# EAGLE schematic BSPD rev10 (EAGLE 9.6.2)
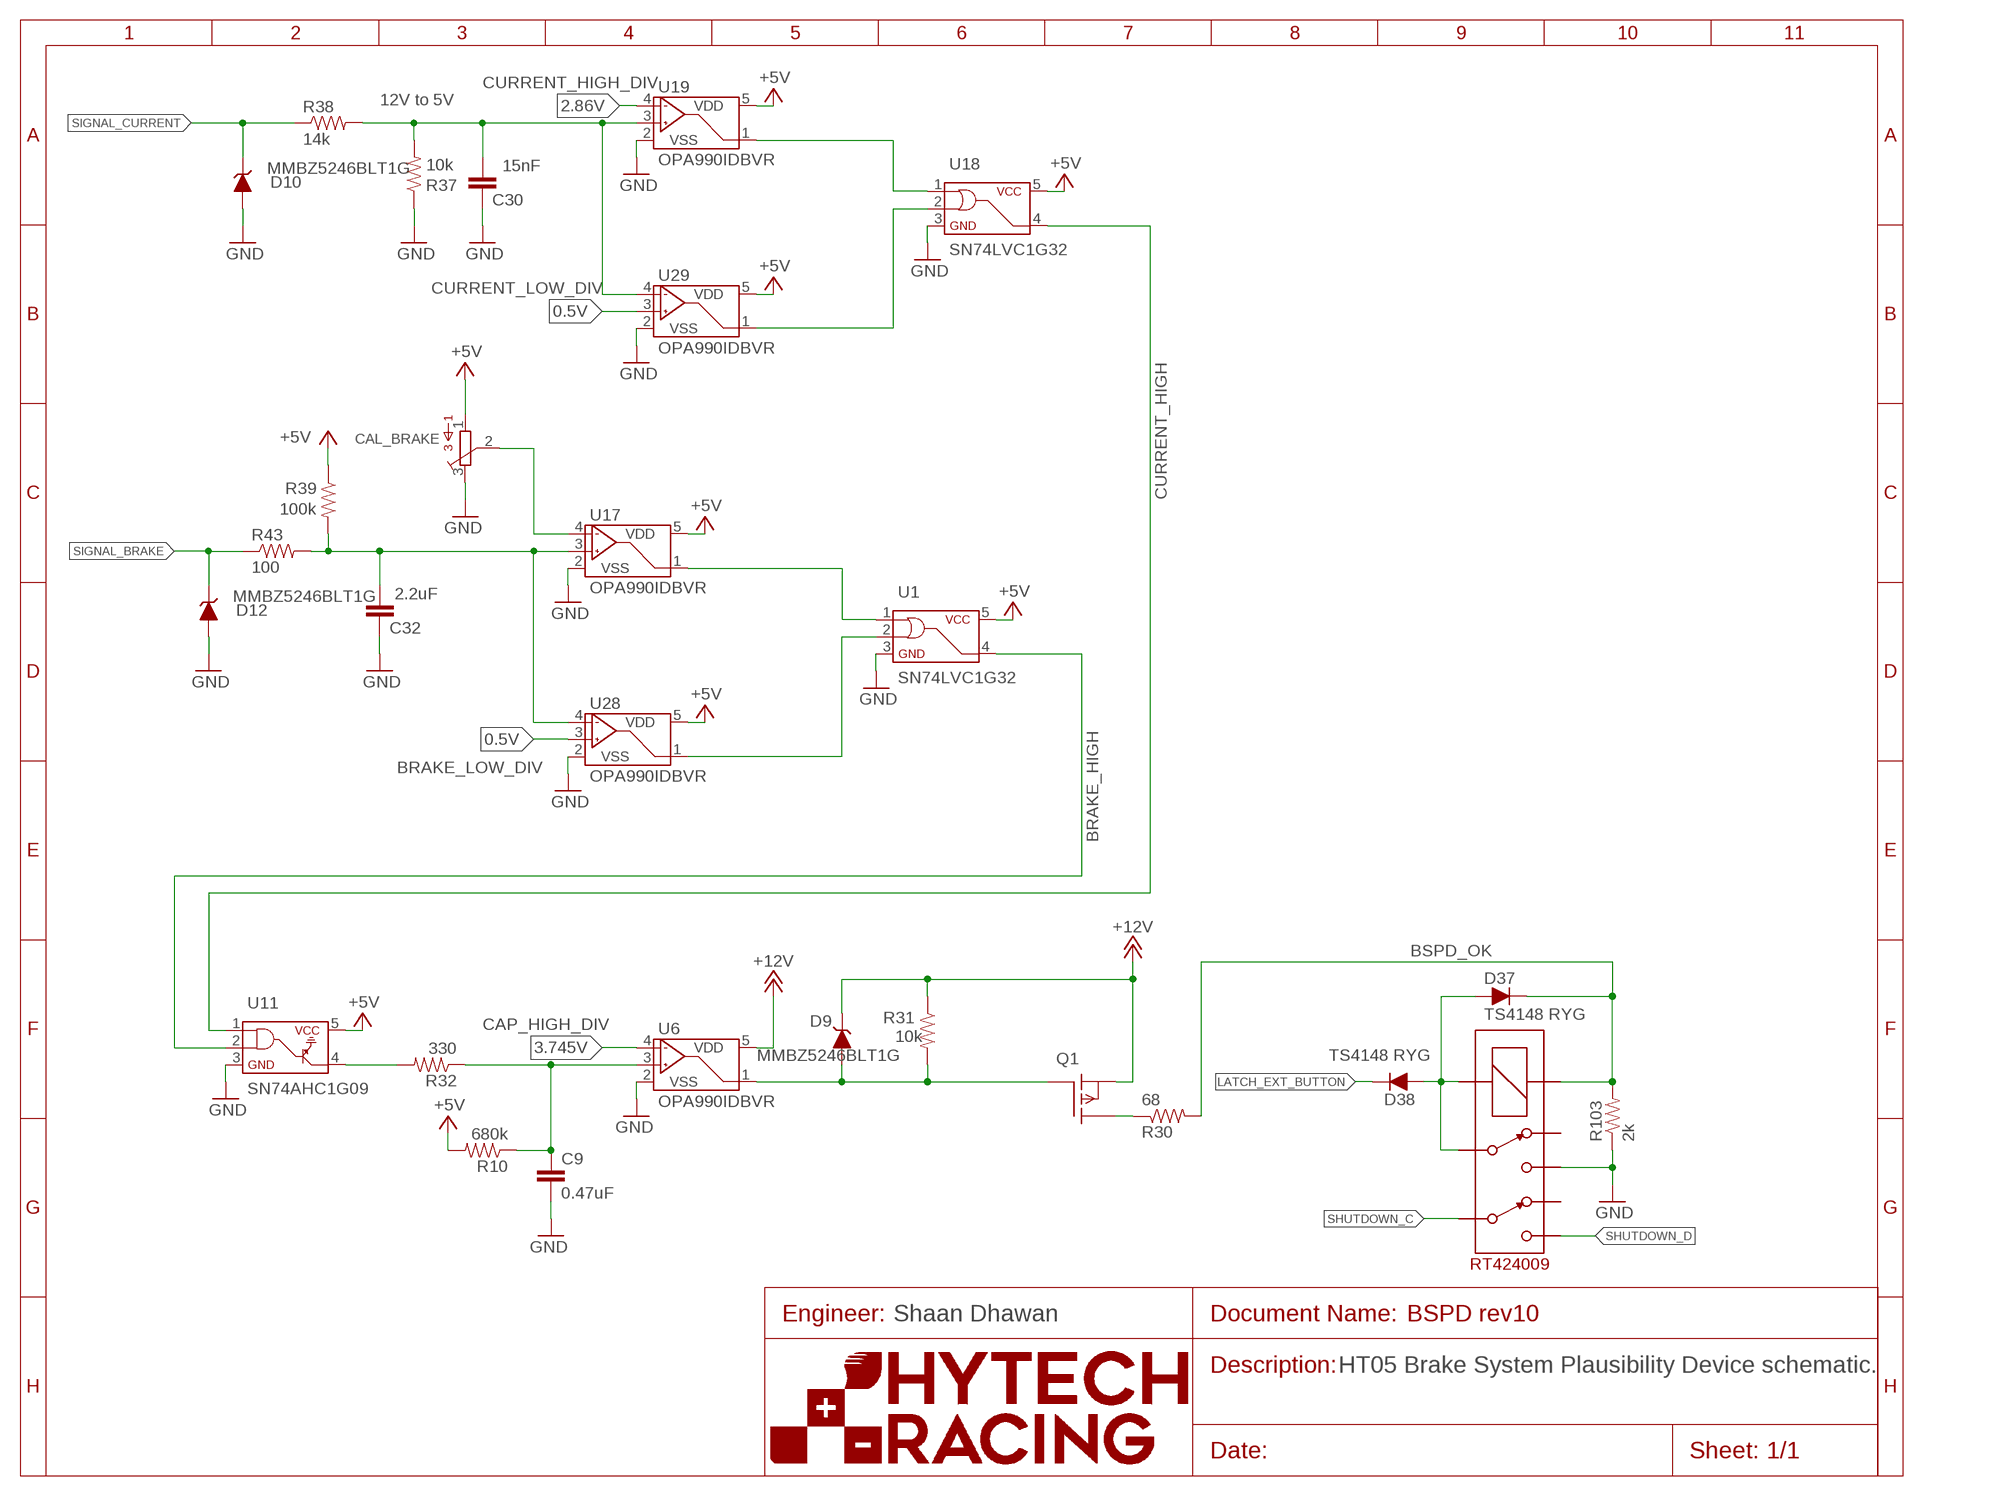
[diagram p0: schematic, sheet 1]
U$1 (FRAME_A): FRAME_DESCRIPTION: Default; ORIENTATION: LANDSCAPE; SIZE: A

## Parts
C9  0.47uF  CAP0603-CAP  [0603-CAP]
C30  15nF  CAP0603-CAP  [0603-CAP]
C32  2.2uF  CAP0603-CAP  [0603-CAP]
CAL_BRAKE  TRIMPOT_3296C  [TRIMPOT_3296]
D9  MMBZ5246BLT1G  DIODE_ZENER  [SOT23]
D10  MMBZ5246BLT1G  DIODE_ZENER  [SOT23]
D12  MMBZ5246BLT1G  DIODE_ZENER  [SOT23]
D37  TS4148 RYG  DIODE0805  [0805_D]
D38  TS4148 RYG  DIODE0805  [0805_D]
Q1  P-CHANNEL_MOSFET_DMP3099L-7  [SOT23]
R10  680k  RESISTOR0603  [0603-RES]
R30  68  RESISTOR0603  [0603-RES]
R31  10k  RESISTOR0603  [0603-RES]
R32  330  RESISTOR0603  [0603-RES]
R37  10k  RESISTOR0603  [0603-RES]
R38  14k  RESISTOR0603  [0603-RES]
R39  100k  RESISTOR0603  [0603-RES]
R43  100  RESISTOR0603  [0603-RES]
R103  2k  RESISTOR0603  [0603-RES]
U1  SN74LVC1G32  SN74LVC1G32"  [SOT-23-5]
U6  OPA990IDBVR  [SOT-23-5@1]
U11  SN74AHC1G09  [SOT-23-5]
U17  OPA990IDBVR  [SOT-23-5@1]
U18  SN74LVC1G32  SN74LVC1G32"  [SOT-23-5]
U19  OPA990IDBVR  [SOT-23-5@1]
U28  OPA990IDBVR  [SOT-23-5@1]
U29  OPA990IDBVR  [SOT-23-5@1]
U$37  RT424009  [RELAY_DPDT]

## Nets
0.5V: U28.3(VIN+) U29.3(VIN+)
2.86V: U19.4(VIN-)
3.745V: U6.4(VIN-)
+5V: CAL_BRAKE.1 R10.2 R39.1 U1.5(VCC) U11.5 U17.5(VDD) U18.5(VCC) U19.5(VDD) U28.5(VDD) U29.5(VDD)
+12V: D9.3(C) Q1.2(S) R31.1 U6.5(VDD)
BRAKE_HIGH: U1.4(Y) U11.2
BRAKE_LOW_DIV: CAL_BRAKE.2 U17.4(VIN-)
BSPD_OK: D37.C R30.2 R103.2 U$37.COIL+
CURRENT_HIGH: U11.1 U18.4(Y)
GND: C9.2 C30.1 C32.1 CAL_BRAKE.3 D10.1(A) D12.1(A) R37.1 R103.1 U1.3(GND) U6.2(VSS) U11.3 U17.2(VSS) U18.3(GND) U19.2(VSS) U28.2(VSS) U29.2(VSS) U$37.4
LATCH_EXT_BUTTON: D38.C
N$1: Q1.3(D) R30.1
N$5: C32.2 R39.2 R43.2 U17.3(VIN+) U28.4(VIN-)
N$6: U1.1(A) U17.1(VOUT)
N$8: U1.2(B) U28.1(VOUT)
N$18: U18.1(A) U19.1(VOUT)
N$19: U18.2(B) U29.1(VOUT)
N$105: D37.A D38.A U$37.3 U$37.COIL-
N$106: C30.2 R37.2 R38.2 U19.3(VIN+) U29.4(VIN-)
N$107: R32.2 U11.4
N$109: C9.1 R10.1 R32.1 U6.3(VIN+)
N$112: D9.1(A) Q1.1(G) R31.2 U6.1(VOUT)
SHUTDOWN_C: U$37.6
SHUTDOWN_D: U$37.5
SIGNAL_BRAKE: D12.3(C) R43.1
SIGNAL_CURRENT: D10.3(C) R38.1
Unconnected: U$37.2 U$37.7

## Notes on the sheet
- CURRENT_HIGH_DIV
- 12V to 5V
- CURRENT_LOW_DIV
- BRAKE_LOW_DIV
- CAP_HIGH_DIV
- Shaan Dhawan
- HT05 Brake System Plausibility Device schematic.

## Library data of the parts
C9 C30 C32 = HyTechDevices:CAP: Capacitor Standard 0603 ceramic capacitor, and 0.1" leaded capacitor.
CAL_BRAKE = HyTechDevices:TRIMPOT_3296: 3296 Series 3/8" Square Trimmer Source <https://github.com/chiengineer/Eagle-Libraries/blob/master/Potentiometers/bourns.lbr>
D9 D10 D12 = HyTechDevices:DIODE_ZENER: ZENER DIODE
D37 D38 = HyTechDevices:DIODE: DIODE general purpose rectifier
Q1 = HyTechDevices:P-CHANNEL_MOSFET_DMP3099L-7: Diodes Incorporated P-Channel Enhancement Mode MOSFET Datasheet <http://www.mouser.com/ds/2/115/DMP3099L-266220.pdf>
R10 R30-R32 R37-R39 R43 R103 = HyTechDevices:RESISTOR: Resistor Basic schematic elements and footprints for 0603, 1206, and PTH resistors.
U1 U18 = HyTechDevices:SN74LVC1G32: TI SN74LVC1G32 Single 2-Input Positive-OR Gate Datasheet <https://www.ti.com/lit/ds/symlink/sn74lvc1g32.pdf?ts=1594782477606&ref_url=https%253A%252F%252Fwww.google.com%252F>
U6 U17 U19 U28 U29 = HyTechDevices:OPA990IDBVR: TI OPA990 20V Op-Amp Comparator Datasheet <https://www.ti.com/lit/ds/symlink/opa990.pdf>
U11 = HyTechDevices:SN74AHC1G09: TI SN74AHC1G09 Single 2–Input Positive-AND Gate With Open-Drain Output Datasheet <http://www.ti.com/lit/ds/symlink/sn74ahc1g09.pdf>
U$37 = HyTechDevices:RT424009: TE/Schrack Double Pull Double Throw Relay 9VDC Datasheet <https://www.mouser.com/datasheet/2/418/NG_DS_RT2_1014-736201.pdf> Product Page <https://www.te.com/usa-en/product-6-1393243-2.html>